# Altium schematic sheet Trigger.SchDoc
size B
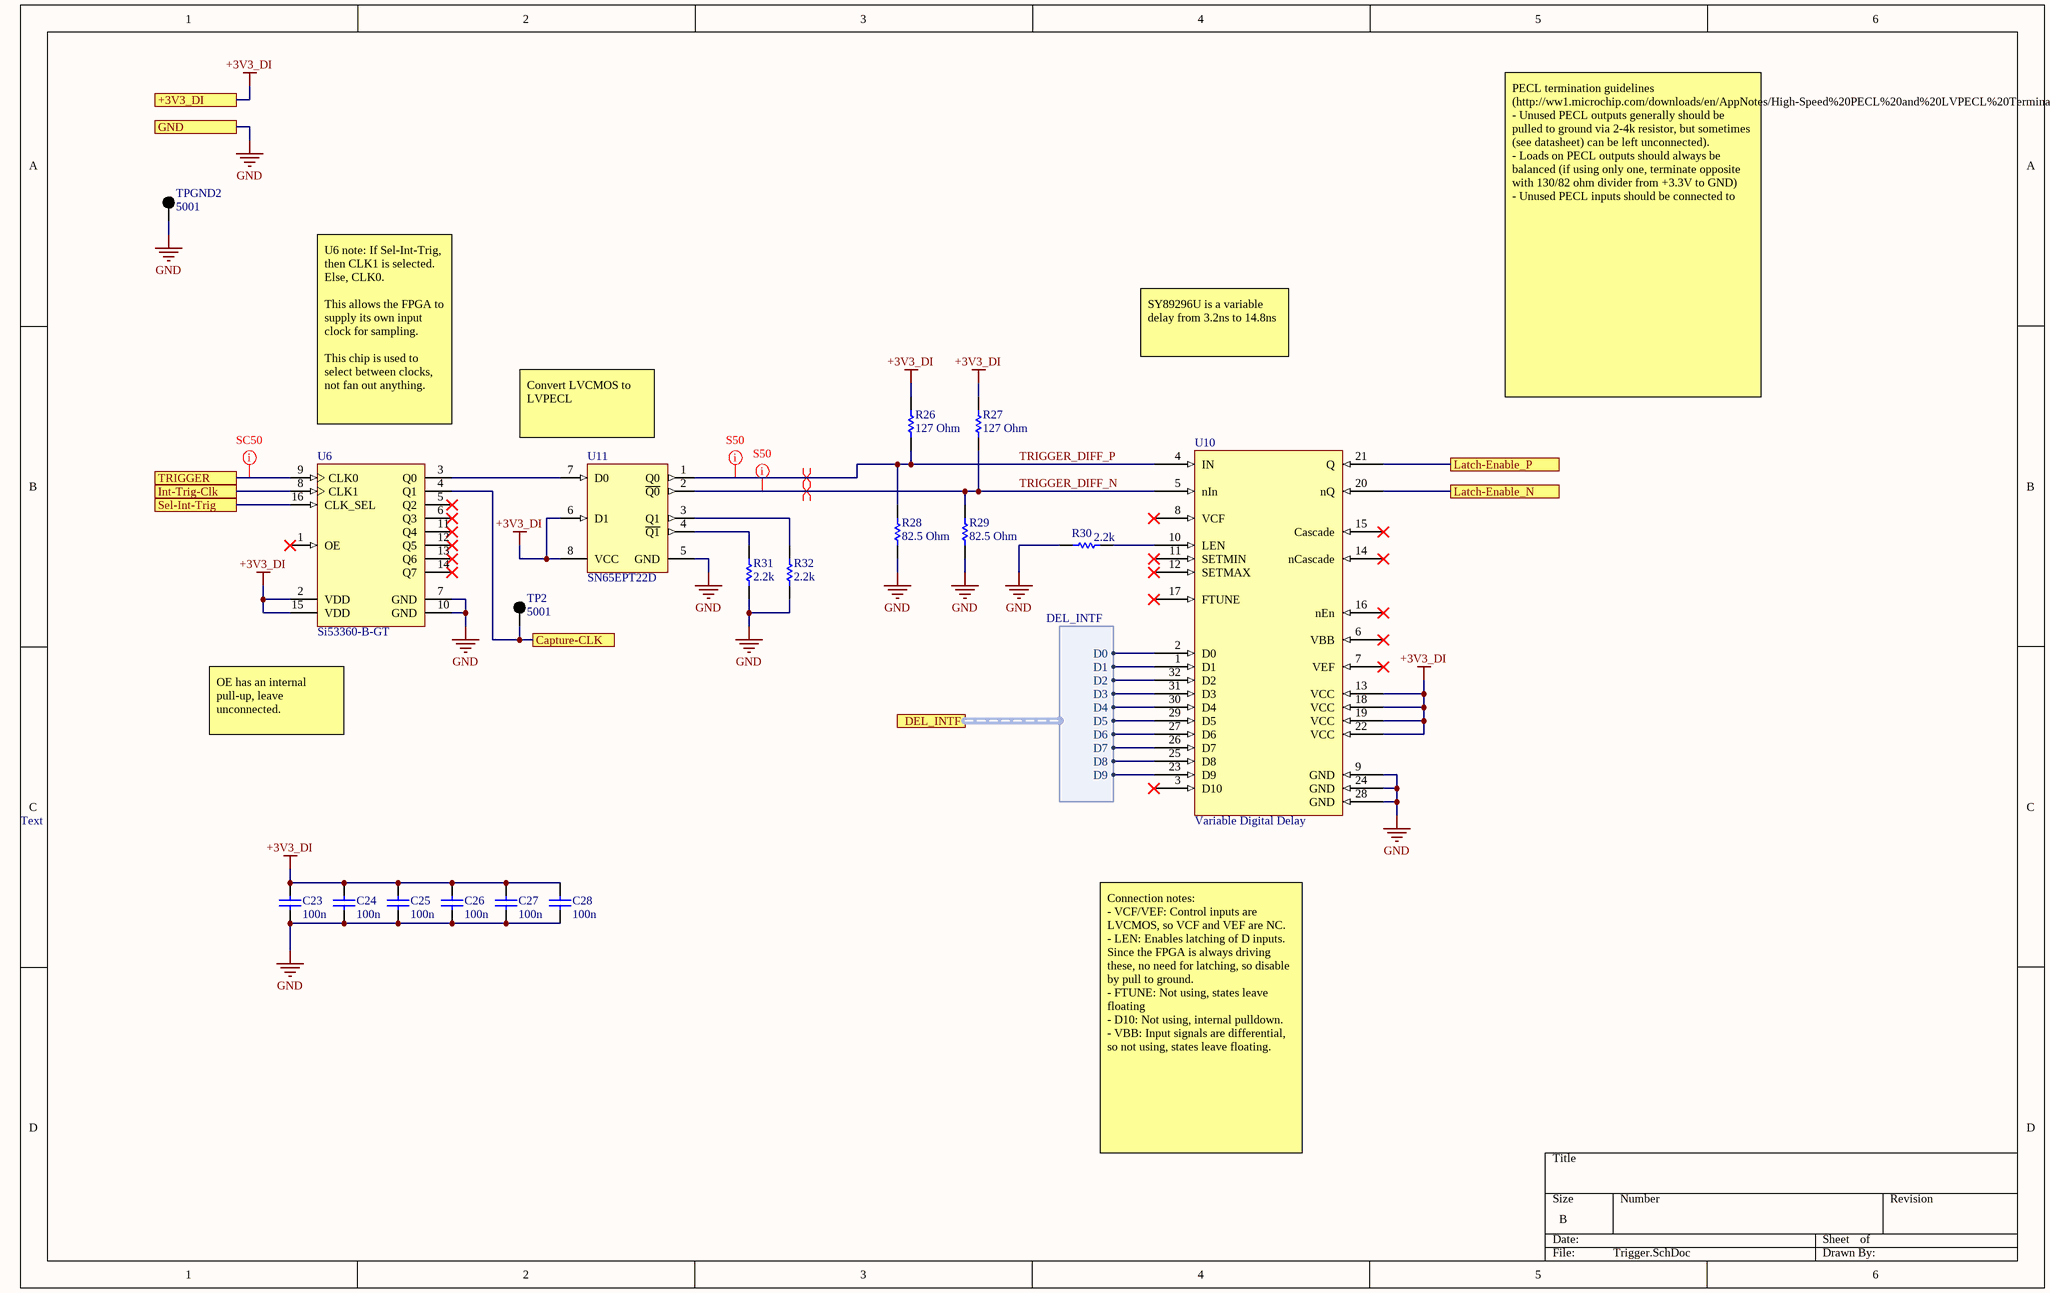
[diagram p0: Trigger.SchDoc]

## Parts
C23  value 100n  [CAPC2013X88X50NL20T25]  (hidden comment: C0805C104K5RACTU)
C24  value 100n  [CAPC2013X88X50NL20T25]  (hidden comment: C0805C104K5RACTU)
C25  value 100n  [CAPC2013X88X50NL20T25]  (hidden comment: C0805C104K5RACTU)
C26  value 100n  [CAPC2013X88X50NL20T25]  (hidden comment: C0805C104K5RACTU)
C27  value 100n  [CAPC2013X88X50NL20T25]  (hidden comment: C0805C104K5RACTU)
C28  value 100n  [CAPC2013X88X50NL20T25]  (hidden comment: C0805C104K5RACTU)
R26  127 Ohm  [RESC2013X50X30NL20T20]
R27  127 Ohm  [RESC2013X50X30NL20T20]
R28  82.5 Ohm  [RESC2013X50X30ML20T20]
R29  82.5 Ohm  [RESC2013X50X30ML20T20]
R30  2.2k  [RESC2013X50X30NL20T20]
R31  2.2k  [RESC2013X50X30NL20T20]
R32  2.2k  [RESC2013X50X30NL20T20]
TP2  5001  [KSTN-5001]
TPGND2  5001  [KSTN-5001]
U6  Si53360-B-GT  [SLAB-TSSOP-16_M]
U10  Variable Digital Delay  [CQFP80P1115X1115X120-32N]
U11  SN65EPT22D  [D0008A_M]

## Ports
+3V3_DI, Capture-CLK, DEL_INTF (harness DEL_INTF), GND, Int-Trig-Clk, Latch-Enable_N, Latch-Enable_P, Sel-Int-Trig, TRIGGER

## Harnesses
DEL_INTF: D0, D1, D2, D3, D4, D5, D6, D7, D8, D9

## Nets
+3V3_DI: C23.2 C24.2 C25.2 C26.2 C27.2 C28.2 R26.2 R27.2 U6.2(VDD) U6.15(VDD) U10.13(VCC) U10.18(VCC) U10.19(VCC) U10.22(VCC) U11.6(D1) U11.8(VCC) ; port +3V3_DI
GND: C23.1 C24.1 C25.1 C26.1 C27.1 C28.1 R28.1 R29.1 R30.1 R31.2 R32.2 TPGND2.1 U6.7(GND) U6.10(GND) U10.9(GND) U10.24(GND) U10.28(GND) U11.5(GND) ; port GND
Capture-CLK: TP2.1 U6.4(Q1) ; port Capture-CLK
Int-Trig-Clk: U6.8(CLK1) ; port Int-Trig-Clk
Latch-Enable_N: U10.20(nQ) ; port Latch-Enable_N
Latch-Enable_P: U10.21(Q) ; port Latch-Enable_P
Sel-Int-Trig: U6.16(CLK_SEL) ; port Sel-Int-Trig
TRIGGER: U6.9(CLK0) ; port TRIGGER
TRIGGER_DIFF_N: R27.1 R29.2 U10.5(nIn) U11.2(~{Q0})
TRIGGER_DIFF_P: R26.1 R28.2 U10.4(IN) U11.1(Q0)
NetR30_2: R30.2 U10.10(LEN)
NetR31_1: R31.1 U11.4(~{Q1})
NetR32_1: R32.1 U11.3(Q1)
NetU6_3: U6.3(Q0) U11.7(D0)
NetU10_1: U10.1(D1) ; port DEL_INTF.D1
NetU10_2: U10.2(D0) ; port DEL_INTF.D0
NetU10_23: U10.23(D9) ; port DEL_INTF.D9
NetU10_25: U10.25(D8) ; port DEL_INTF.D8
NetU10_26: U10.26(D7) ; port DEL_INTF.D7
NetU10_27: U10.27(D6) ; port DEL_INTF.D6
NetU10_29: U10.29(D5) ; port DEL_INTF.D5
NetU10_30: U10.30(D4) ; port DEL_INTF.D4
NetU10_31: U10.31(D3) ; port DEL_INTF.D3
NetU10_32: U10.32(D2) ; port DEL_INTF.D2

Not connected (* = marked no-connect by the designer): U6 1(OE)* 5(Q2)* 6(Q3)* 11(Q4)* 12(Q5)* 13(Q6)* 14(Q7)*; U10 3(D10)* 6(VBB)* 7(VEF)* 8(VCF)* 11(SETMIN)* 12(SETMAX)* 14(nCascade)* 15(Cascade)* 16(nEn)* 17(FTUNE)*

## Layout directives
net class SC50: TRIGGER
net class S50: TRIGGER_DIFF_N, TRIGGER_DIFF_P
differential pair: TRIGGER_DIFF_N, TRIGGER_DIFF_P

## Notes on the sheet
- SY89296U is a variable delay from 3.2ns to 14.8ns
- U6 note: If Sel-Int-Trig, then CLK1 is selected. Else, CLK0.
  This allows the FPGA to supply its own input clock for sampling.
  This chip is used to select between clocks, not fan out anything.
- (near U11) Convert LVCMOS to LVPECL
- PECL termination guidelines (http://ww1.microchip.com/downloads/en/AppNotes/High-Speed%20PECL%20and%20LVPECL%20Termination.pdf):
  - Unused PECL outputs generally should be pulled to ground via 2-4k resistor, but sometimes (see datasheet) can be left unconnected).
  - Loads on PECL outputs should always be balanced (if using only one, terminate opposite with 130/82 ohm divider from +3.3V to GND)
  - Unused PECL inputs should be connected to
- OE has an internal pull-up, leave unconnected.
- Text
- Connection notes:
  - VCF/VEF: Control inputs are LVCMOS, so VCF and VEF are NC.
  - LEN: Enables latching of D inputs. Since the FPGA is always driving these, no need for latching, so disable by pull to ground.
  - FTUNE: Not using, states leave floating
  - D10: Not using, internal pulldown.
  - VBB: Input signals are differential, so not using, states leave floating.

## Library data of the parts
C23-C28 = CMP-2007-00279-1: Manufacturer: Kemet; Part Number: C0805C104K5RACTU
R26 R27 = CMP-2001-04933-1: Manufacturer: Vishay Dale; Part Number: CRCW0805127RFKEA
R28 R29 = CMP-2001-04138-1: Part Number: CRCW080582R5FKEA; Manufacturer: Vishay Dale
R30-R32 = CMP-2001-03760-1: Part Number: CRCW08052K20FKEA; Manufacturer: Vishay Dale
TP2 TPGND2 = CMP-2000-05181-1: Test Point, Black, 1-Pin THD, RoHS, Bulk; Manufacturer: Keystone; Other Names: 5001K; Catalog Drawings: 5000Series; Alternate Color: 5004K-ND / -TESTPOINTPCMINI.040"DYELLOW / 5003K-ND / -TESTPOINTPCMINI.040"DORANGE / 5002K-ND / -TESTPOINTPCMINI.040"DWHITE / 5000K-ND / -TESTPOINTPCMINI.040"DRED; Kits: DKTGRS232C-KIT-ND / -TTLCONVERTER; Online Catalog: ColorCodedTestPoints; Datasheet URL: https://ciiva.com/datasheet-click-2917627?src=ciiva&sig=bd195616; Mounting Type: 0.040"(1.02mm)HoleDiameter; Family: TestPoints; RoHS Information: RoHSComplianceStatement; Datasheet Version: Rev. G, 12/2008; Color: Black; Category: TestandMeasurement; Standard Package: 100; Manufacturer URL: http://www.keyelco.com/; Material: Base,Nylon46,UL94V-0; Type: PCTestPoint,Miniature; Terminal: 0.010"x0.020"(0.25mmx0.51mm)PhosphorBronzeWire,SilverPlated; Series: THM; Packaging: Bulk
U6 = CMP-0510-00562-1: 1:8 Low Jitter CMOS Clock Buffer with 2:1 Input Mux, 1 to 200 MHz, -40 to 85 degC, 16-pin SOP; Manufacturer: Silicon Labs; Sub-Family: Clock Buffers; Output Format: LVCMOS; Frequency (MHz): 1 to 200; Mounting Technology: Surface Mount; ComponentLink3Description: Package Specification; PartNumber: Si53360-B-GT; PackageReference: TSSOP-16; ComponentLink2URL: http://www.silabs.com/Support%20Documents/TechnicalDocs/Si53360.pdf; DatasheetVersion: Rev. 0.4; Code_IPC: J-STD-020C; PackageDescription: 16-Pin Thin Shrink Small-Outline Package, Body 5 x 4.4 mm, Pitch 0.65 mm; Code_JEDEC: MO-153; ComponentLink1Description: Manufacturer URL; ComponentLink3URL: http://www.silabs.com/Support%20Documents/TechnicalDocs/Si53360.pdf; ComponentLink2Description: Datasheet; ComponentLink1URL: http://www.silabs.com/
U10 = SY89296U
U11 = CMP-0327-00041-3: 4000 Mbps 3.3 V Dual LVTTL / LVCMOS to Differential LVPECL Buffer, 2 Tx and 2 Rx, -40 to +85 degC, 8-pin SOIC (D), Green (RoHS & no Sb/Br); Manufacturer: Texas Instruments; No. of Tx: 2; SubFamily: PECL PHY; ICC(Max)(mA): 50; Signaling Rate(Mbps): 4000; xECL: TRUE; Input Signal: LVTTL, CMOS; PackageDescription: 8-Pin Plastic Small Outline Integrated Circuit, 4.9 x 3.9 mm, Pitch 1.27 mm Pitch; ComponentLink1Description: Manufacturer URL; No. of Rx: 2; Eco-Plan: Green (RoHS & no Sb/Br); Mounting Technology: Surface Mount; ComponentLink2URL: http://www.ti.com/general/docs/lit/getliterature.tsp?genericPartNumber=SN65EPT22&fileType=pdf; ComponentLink3URL: SamplesURL:http://www.ti.com/product/sn65ept22#samples; DatasheetVersion: SLLS926A; PartNumber: SN65EPT22D; PackageReference: D0008A; ComponentLink2Description: Datasheet; ComponentLink1URL: http://www.ti.com/; ComponentLink3Description: URL Link1; Output Signal: LVPECL; PackageVersion: revM, Jun-2011